# EAGLE design rocketpin (EAGLE 7.7.0)
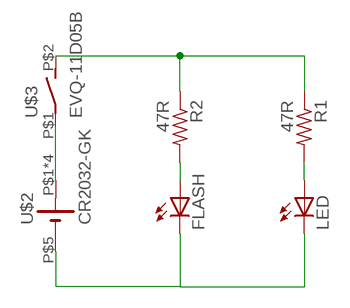
[diagram p0: schematic, sheet 1]

## Parts
FLASH  LED5MM  [LED5MM]
LED  LED5MM  [LED5MM]
R1  47R  R-US_0207/10  [0207/10]
R2  47R  R-US_0207/10  [0207/10]
U$2  CR2032-GK  [BAT-HLD-001-THM]
U$3  EVQ-11D05B  [SPST-5MM]

## Nets
GND: FLASH.K(C) LED.K(C) U$2.P$5(-)
N$1: R1.1 R2.1 U$3.P$2(S)
N$2: LED.A R1.2
N$3: FLASH.A R2.2
N$6: U$2.P$1(+) U$2.P$2(+) U$2.P$3(+) U$2.P$4(+) U$3.P$1(P)

## Library data of the parts
FLASH LED = led:LED: LED OSRAM: - CHIPLED LG R971, LG N971, LY N971, LG Q971, LY Q971, LO R971, LY R971 LH N974, LH R974 LS Q976, LO Q976, LY Q976 LO Q996 - Hyper CHIPLED LW Q18S LB Q993, LB Q99A, LB R99A - SideLED LS A670, LO A670, LY A670, LG A670, LP A670 LB A673, LV A673, LT A673, LW A673 LH A674 LY A675 LS A676, LA A676, LO A676, LY A676, LW A676 LS A679, LY A679, LG A679 - Hyper Micro SIDELED® LS Y876, LA Y876, LO Y876, LY Y876 LT Y87S - SmartLED LW L88C, LW L88S LB L89C, LB L89S, LG L890 LS L89K, LO L89K, LY L89K LS L896, LA L896, LO L896, LY L896 - TOPLED LS T670, LO T670, LY T670, LG T670, LP T670 LSG T670, LSP T670, LSY T670, LOP T670, LYG T670 LG T671, LOG T671, LSG T671 LB T673, LV T673, LT T673, LW T673 LH T674 LS T676, LA T676, LO T676, LY T676, LB T676, LH T676, LSB T676, LW T676 LB T67C, LV T67C, LT T67C, LS T67K, LO T67K, LY T67K, LW E67C LS E67B, LA E67B, LO E67B, LY E67B, LB E67C, LV E67C, LT E67C LW T67C LS T679, LY T679, LG T679 LS T770, LO T770, LY T770, LG T770, LP T770 LB T773, LV T773, LT T773, LW T773 LH T774 LS E675, LA E675, LY E675, LS T675 LS T776, LA T776, LO T776, LY T776, LB T776 LHGB T686 LT T68C, LB T68C - Hyper Mini TOPLED® LB M676 - Mini TOPLED Santana® LG M470 LS M47K, LO M47K, LY M47K Source: http://www.osram.convergy.de LUXEON: - LUMILED® LXK2-PW12-R00, LXK2-PW12-S00, LXK2-PW14-U00, LXK2-PW14-V00 LXK2-PM12-R00, LXK2-PM12-S00, LXK2-PM14-U00 LXK2-PE12-Q00, LXK2-PE12-R00, LXK2-PE12-S00, LXK2-PE14-T00, LXK2-PE14-U00 LXK2-PB12-K00, LXK2-PB12-L00, LXK2-PB12-M00, LXK2-PB14-N00, LXK2-PB14-P00, LXK2-PB14-Q00 LXK2-PR12-L00, LXK2-PR12-M00, LXK2-PR14-Q00, LXK2-PR14-R00 LXK2-PD12-Q00, LXK2-PD12-R00, LXK2-PD12-S00 LXK2-PH12-R00, LXK2-PH12-S00 LXK2-PL12-P00, LXK2-PL12-Q00, LXK2-PL12-R00 Source: www.luxeon.com KINGBRIGHT: KA-3528ASYC Source: www.kingbright.com
R1 R2 = resistor:R-US_: RESISTOR, American symbol
U$2 = battery:CR2032-GK
U$3 = switch:EVQ-11D05B: EVQ-11D05B Panasonic Tactile Switches Switch, Light Touch, SMD, 3.5x2.9mm Righ Side-operational Half Dive, L-Shape 2.2N, H=0.7mm

## Board
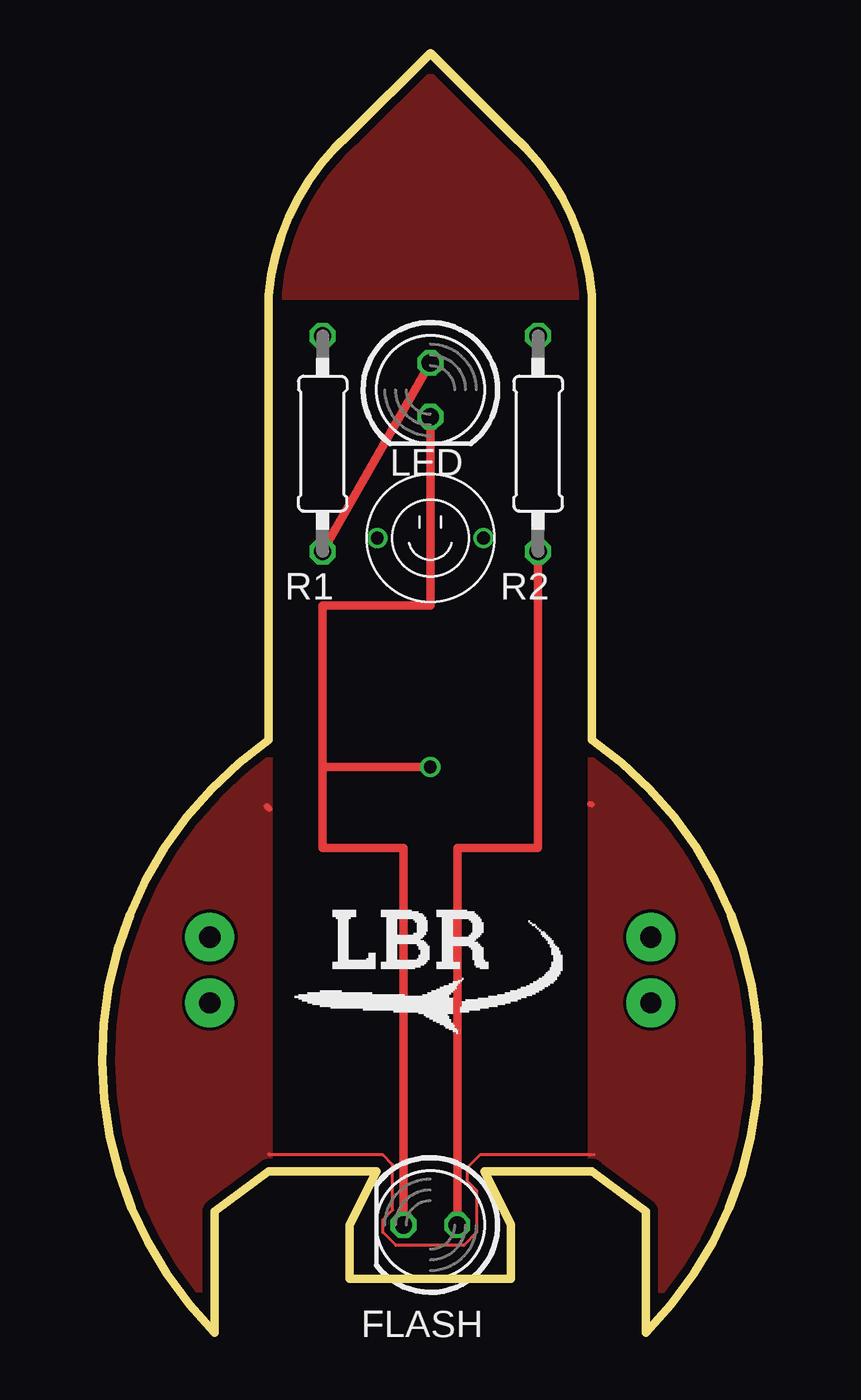
[diagram p1: board, top side]
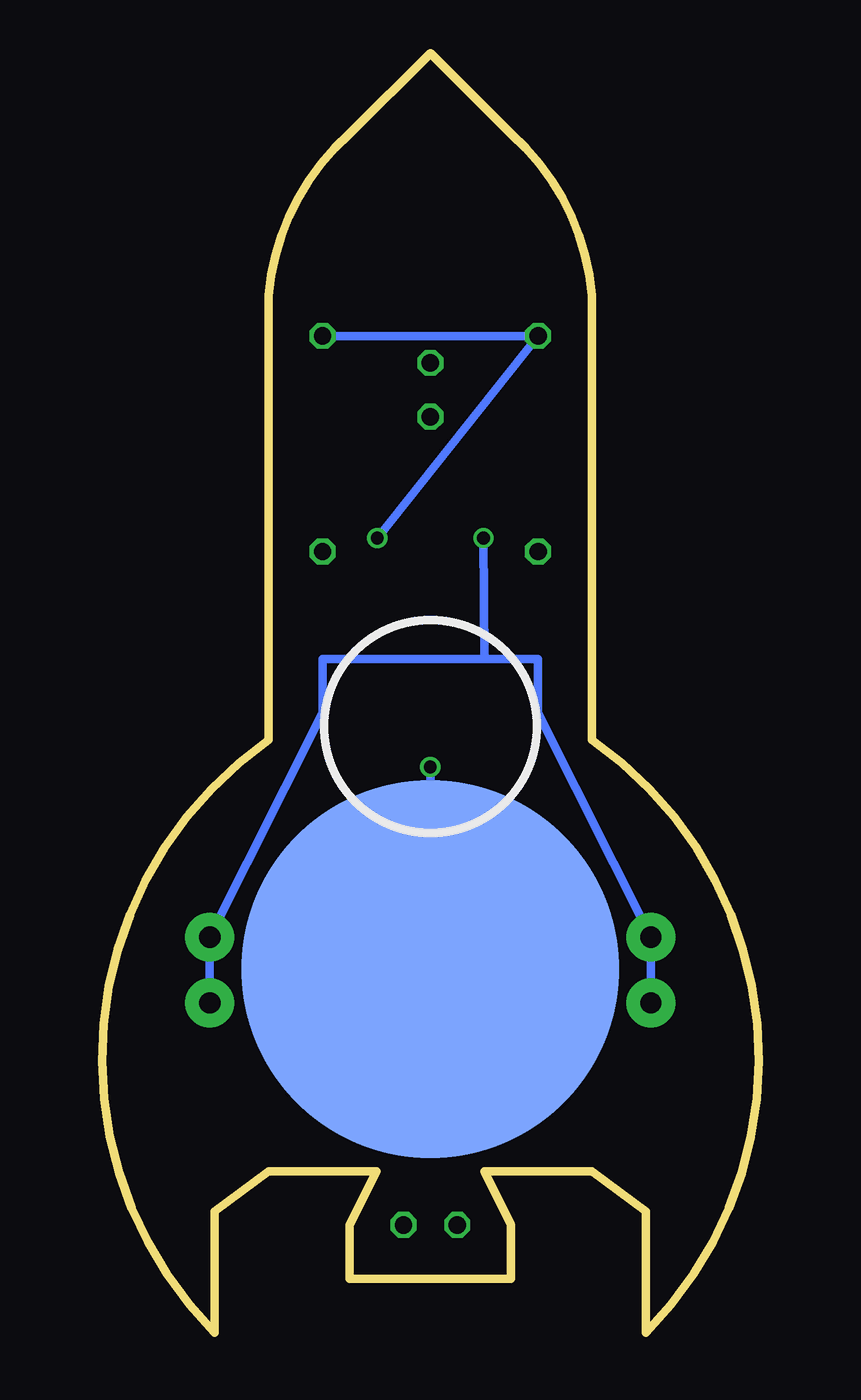
[diagram p2: board, bottom side, seen from below]

Size 30.96 x 60.33 mm. Coordinates in mm from the lower left corner, seen from the top.
Outline: 7.86,27.94 7.86,48.9 arc-44 11.67,56.52 15.48,60.33 19.29,56.52 arc-44 23.1,48.9 23.1,27.94 arc-100 25.64,0 25.64,5.71 23.1,7.62 18.02,7.62 19.29,5.08 19.29,2.54 11.67,2.54 11.67,5.08 12.94,7.62 7.86,7.62 5.32,5.71 5.32,0 arc-100 7.86,27.94
Copper layers (1*16): Top 0.0356mm / dielectric 1.5011mm / Bottom 0.0356mm
Design rules "LaenPCBOrder": minimum track width 6mil, minimum drill 13mil, track to track 6mil, track to pad 6mil, pad to pad 6mil, via to via 6mil, smd to smd 6mil, copper to edge 15mil, drill to drill 6mil, minimum pad ring 7mil, minimum via ring 7mil, stop-mask expansion 3mil, vias tented up to drill 0mil, thermal gap 10mil

### Footprints (pad centres in the part's own frame; a part is rotated, then mirrored left to right if it is on the bottom)
LED5MM = drill 0.813 octagon: A -1.27,0; K 1.27,0
0207/10 = drill 0.813 octagon: 1 -5.08,0; 2 5.08,0
BAT-HLD-001-THM = drill 1 pad 2.3: P$1 10.4,1.5; P$2 10.4,-1.6; P$3 -10.4,1.5; P$4 -10.4,-1.6 | smd 17.8 x 17.8: P$5 0,0
SPST-5MM = drill 0.6: P$1 -2.5,0; P$2 2.5,0

### Placement (x,y rotation side)
FLASH  15.48,5.08 180 top
LED  15.48,44.45 270 top
R1  10.4,41.91 270 top
R2  20.56,41.91 270 top
U$1  [LOGO-0.50"]  9.13,13.97 0 top
U$2  15.48,17.14 0 bottom
U$3  15.48,37.47 0 top

### Tracks (layer width: path | path; a pad name or v marks a point on that pad's centre or on a via)
GND  (via drill 0.6)
  Top 0.406: FLASH.K 14.21,22.86 10.4,22.86 10.4,26.67 | 10.4,26.67 10.4,34.29 15.48,34.29 LED.K | v15.48,26.67 10.4,26.67
  Bottom 0.406: U$2.P$5 v15.48,26.67
N$1
  Bottom 0.406: R2.1 R1.1 U$3.P$2
N$2
  Top 0.406: R1.2 LED.A
N$3
  Top 0.406: FLASH.A 16.75,22.86 20.56,22.86 R2.2
N$4
  pour Top: 7.86,48.9 23.1,48.9 21.83,53.98 15.48,60.33 11.67,56.52 9.13,52.7
N$5
  Top 0.152: 7.91,8.38 13.24,8.38 13.7,7.92 13.7,5.79 13.24,5.33 13.24,4.72 13.85,4.12 17.05,4.12 17.66,4.72 17.66,6.71 17.21,7.16 17.21,7.77 17.82,8.38 23,8.38 | 7.91,8.38 7.86,8.41 | 23,8.38 23.1,8.41 | 7.91,8.38 7.86,8.41 | 23,8.38 23.2,8.41
  Top 0.254: 23,24.92 23.1,24.9 | 7.91,24.69 7.76,24.82
  pour Top: 23.1,27.94 23.1,7.62 25.64,5.08 25.64,-2.54 28.18,0 31.35,6.99 31.35,13.97 29.45,20.95 26.91,24.77
  pour Top: 7.86,27.94 7.86,7.62 5.32,5.08 5.32,-2.54 2.78,0 -0.4,6.99 -0.4,13.97 1.51,20.95 4.05,24.77
N$6
  Bottom 0.406: U$2.P$2 U$2.P$1 10.4,29.21 10.4,31.75 12.94,31.75 | U$2.P$4 U$2.P$3 20.56,29.21 20.56,31.75 12.94,31.75 | U$3.P$1 12.94,31.75

### Text on the board
tPlace: /home/giselle/Pictures/lbr_square.bmp